# EasyEDA Pro project ProProject_NFC_SJTU-电院版本-NFC名片.epro

# Schematic Schematic1
Create Date: 2023-11-04; Page Name: P1; Project Name: NFC_SJTU-电院版本V4.2; Schematic Name: Schematic1; Update Date: 2023-11-04; Company: 嘉立创EDA; Page Size: A4; Version: V1.0
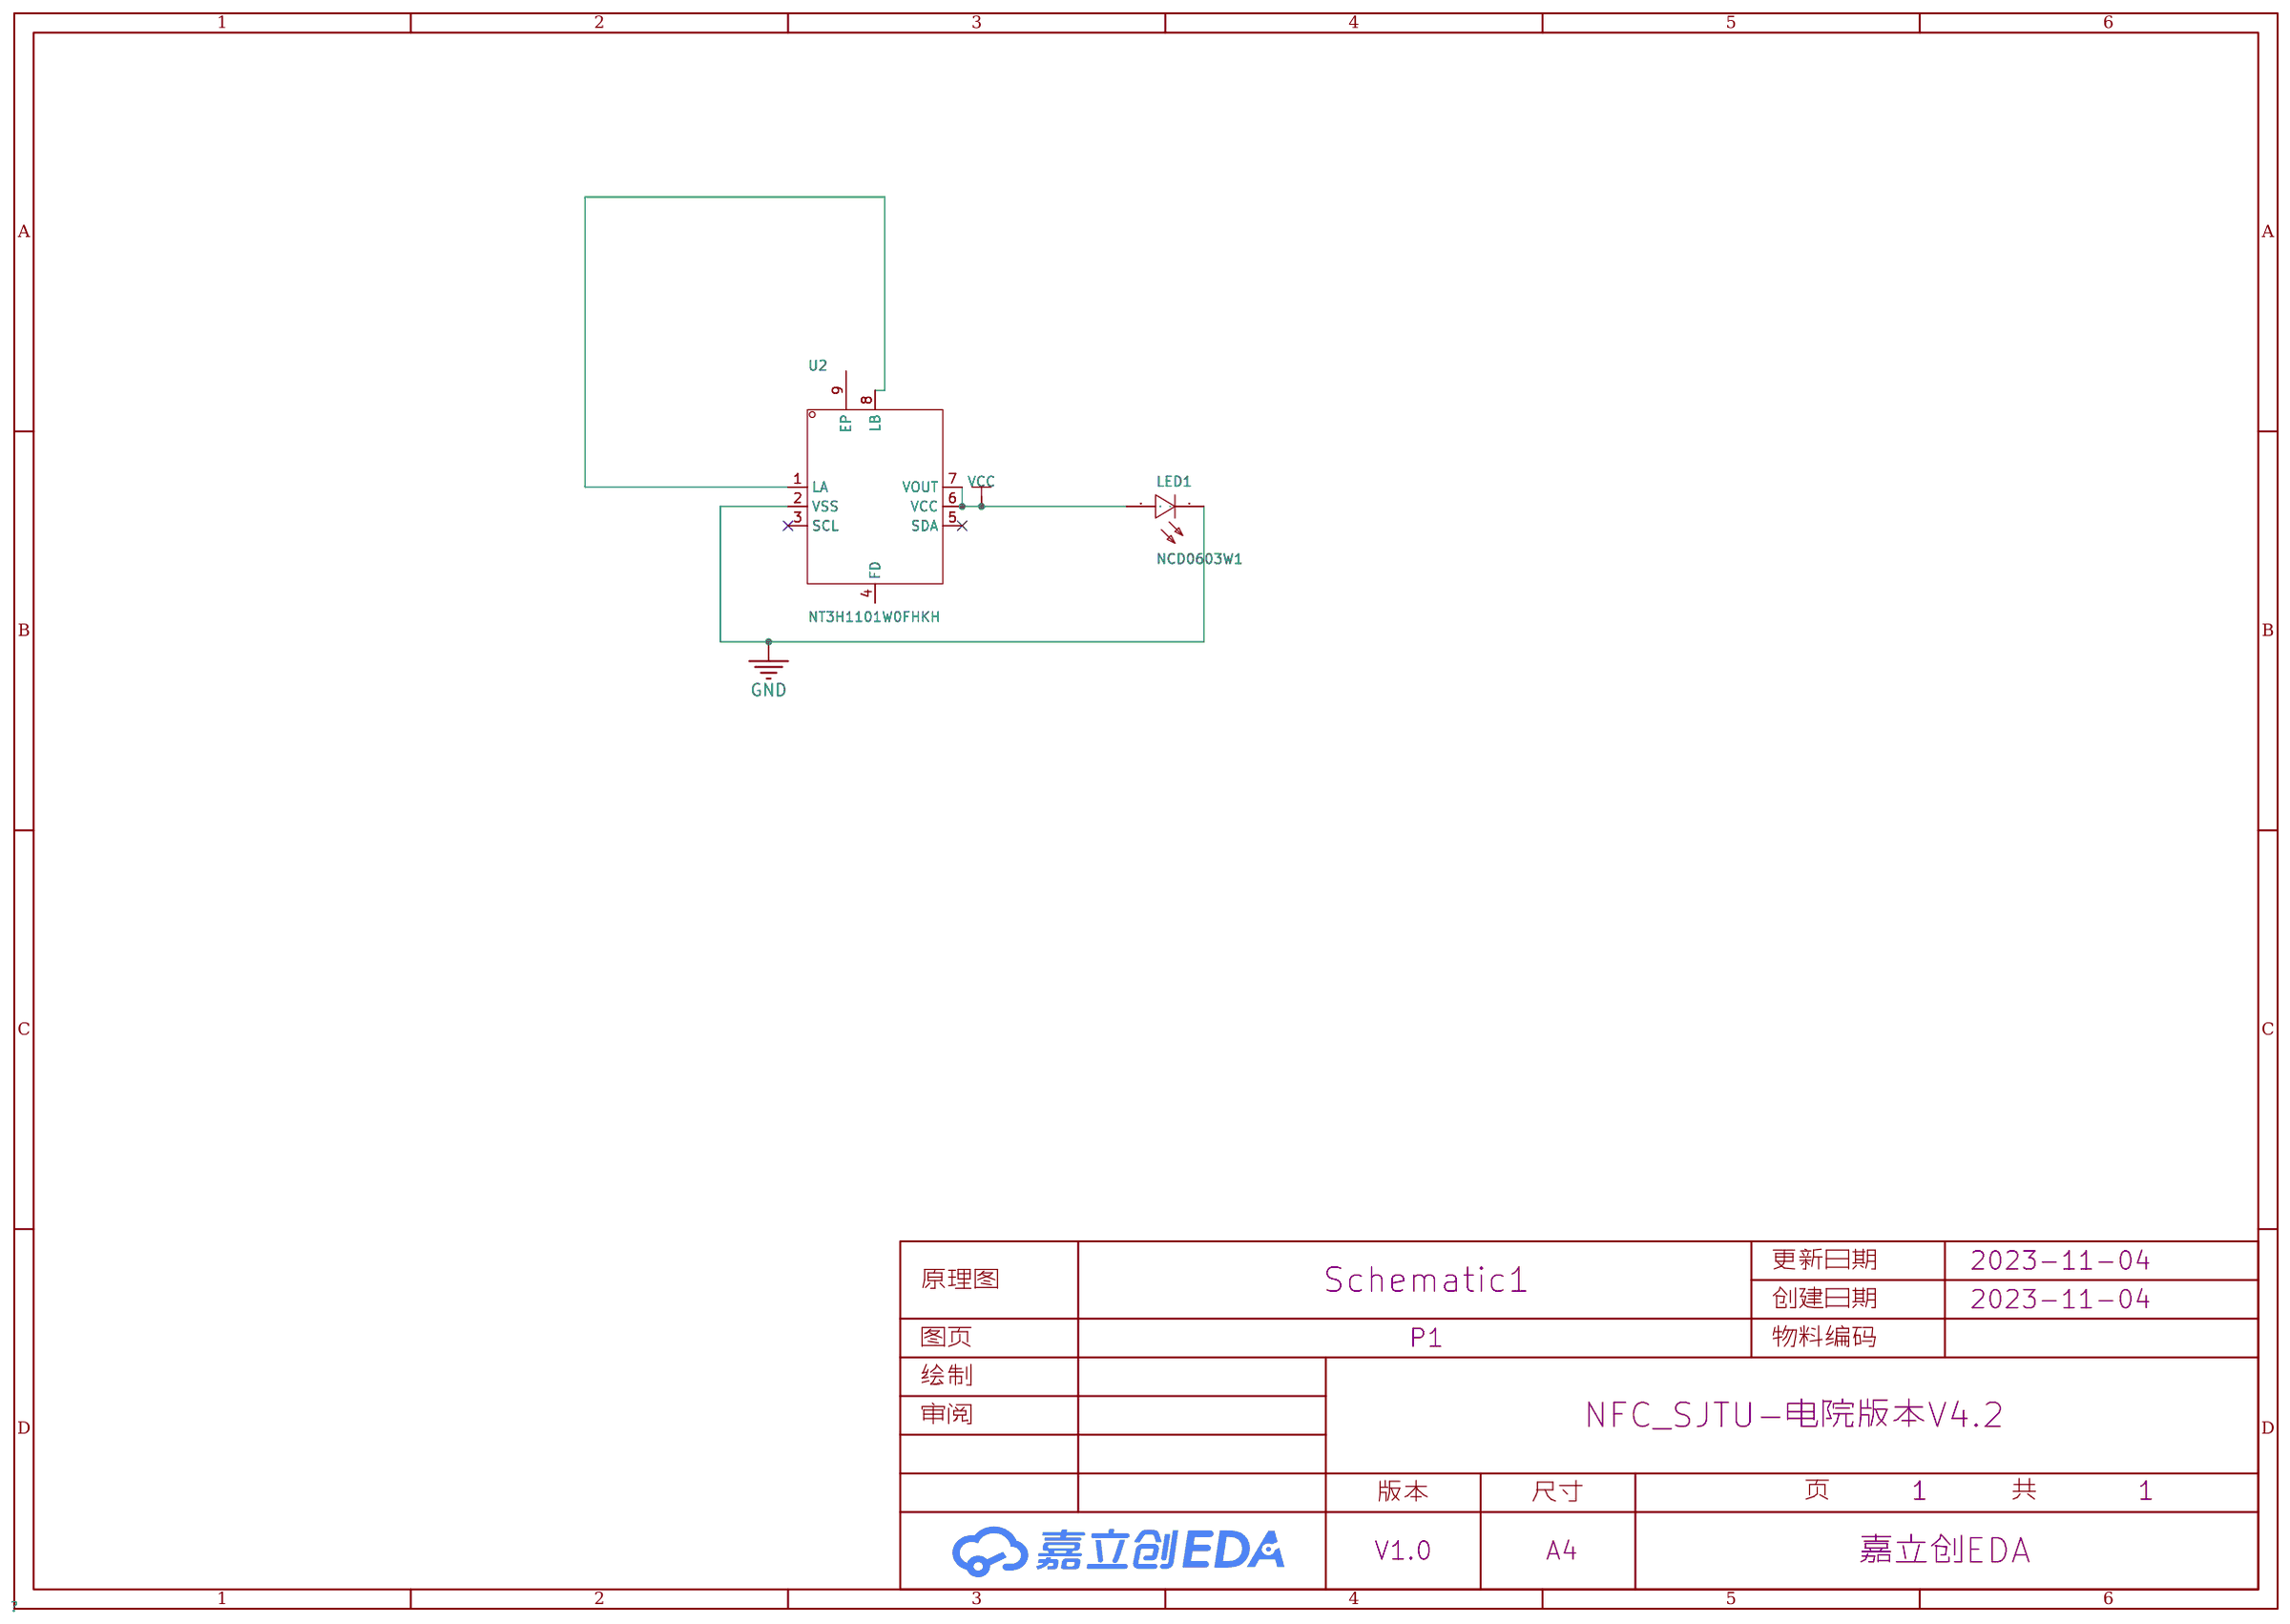
[diagram p0: schematic sheet]

## Parts
LED1  NCD0603W1  [LED0603-RD]
U2  NT3H1101W0FHKH  [XQFN-8_L1.6-W1.6-P0.50-BR]

## Library data of the parts
LED1 = NCD0603W1: 发光颜色:白灯;; Supplier Part: C84265; Manufacturer: 国星光电; Supplier Footprint: 0603; Datasheet: https://atta.szlcsc.com/upload/public/pdf/source/20200820/C84265_479E6193713348A548E5CD6D9278BF16.pdf; Supplier: LCSC; Emitted Color: 白灯
U2 = NT3H1101W0FHKH: Supplier Part: C73156; Manufacturer: NXP(恩智浦); Supplier Footprint: XQFN-8(1.6x1.6); Datasheet: https://atta.szlcsc.com/upload/public/pdf/source/20171113/C73156_15105616225541116096.pdf; Supplier: LCSC

## Nets
GND: LED1.1(-) U2.2(VSS)
VCC: LED1.2(+) U2.6(VCC) U2.7(VOUT)
$1N599: U2.1(LA) U2.8(LB)

Not connected (* = marked no-connect by the designer): U2 3(SCL)* 4(FD) 5(SDA)* 9(EP)

# Board PCB2
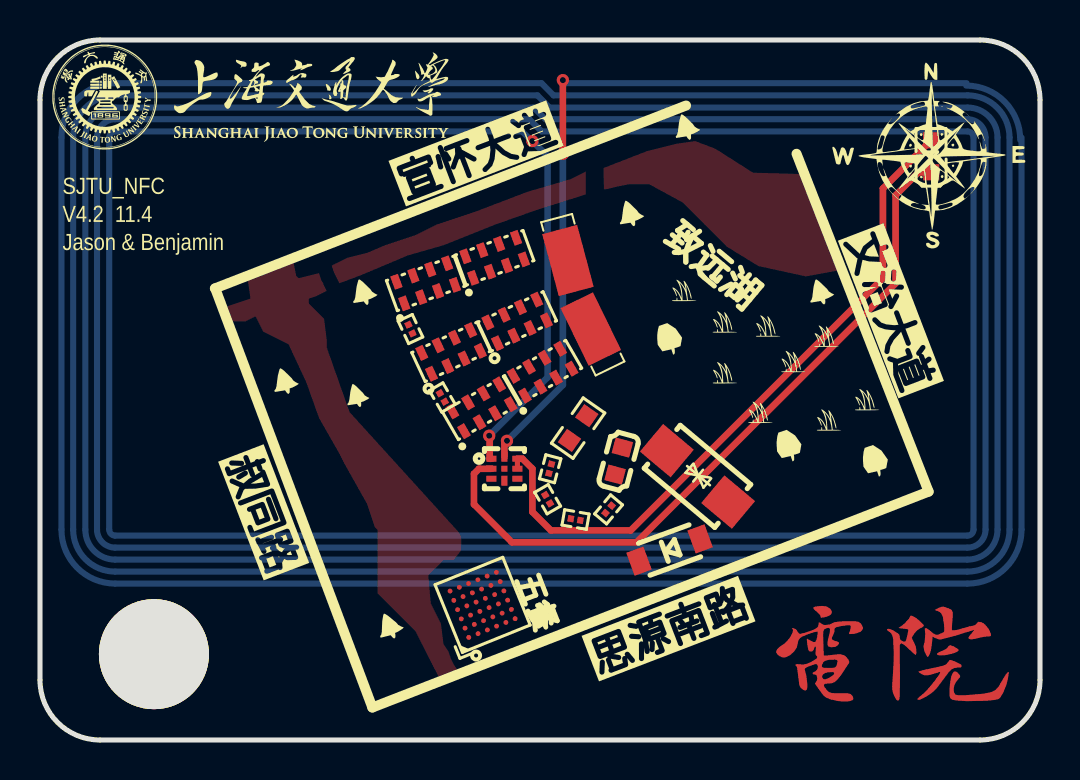
[diagram p1: board, top side]
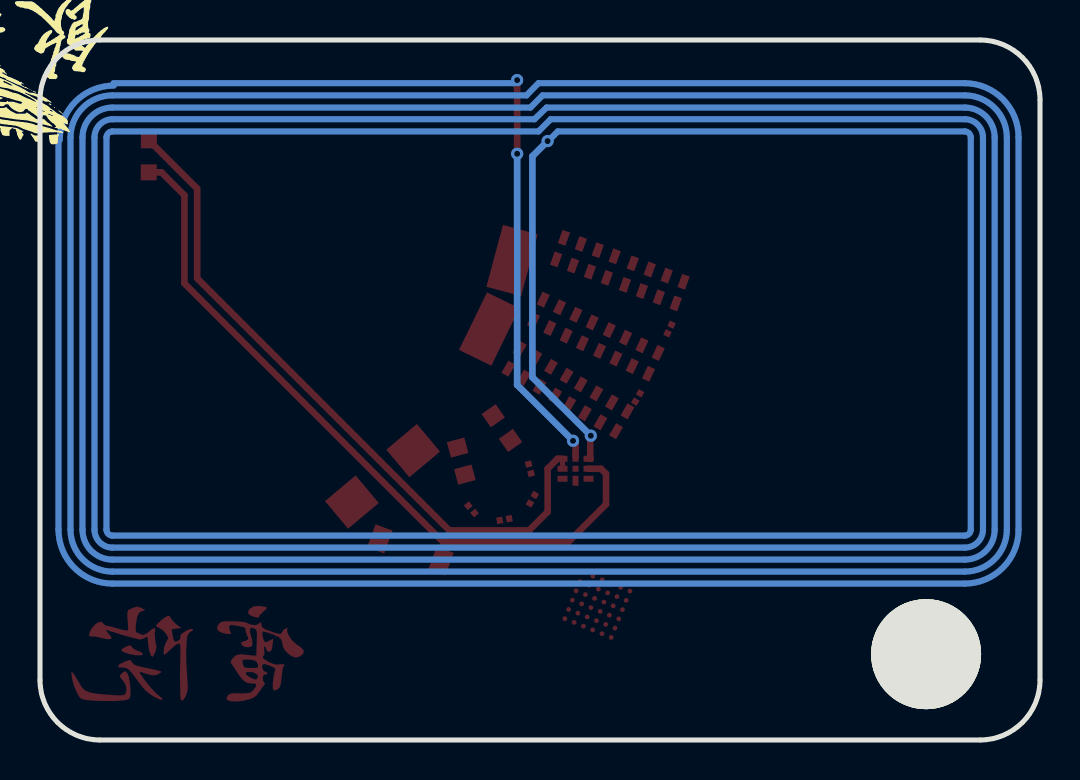
[diagram p2: board, bottom side, seen from below]

Outline 50 x 35 mm; copper layers: Top Layer, Bottom Layer. Coordinates in mm from the lower left corner of the outline.
Outline path: 0,32 0,3 arc(0.88,0.88) 3,0 47,0 arc(49.12,0.88) 50,3 50,32 arc(49.12,34.12) 47,35 3,35 arc(0.88,34.12) 0,32
Stack: Top Layer 0.035mm / Dielectric1 1.51mm FR4 er 4.5 / Bottom Layer 0.035mm

## Design rules (mm)
template: JLCPCB Capability(Two Layers Board)
spacing copperThickness1oz (default): track to track 0.102, other pairs 0.152 to 0.3
spacing copperThickness2oz: track to track 0.203, other pairs 0.152 to 0.3
track width copperThickness1oz (default): min 0.127, default 0.254, max 2.54
track width copperThickness2oz: min 0.203, default 0.254, max 2.54
differential pair differentialPair (default): width min 0.127, default 0.254, max 2.54; gap min 0.152, default 0.152
via viaSize (default): diameter min 0.5, default 0.61, max 10; hole min 0.3, default 0.305, max 6.3

## Placement (name value [footprint] x y rotation side)
C1  100nF  [C0603]  28.94 13.94 75 top
D1  -  [SOD-123_L2.7-W1.6-LS3.7-R-RD]  31.48 9.5 20 top
LED1  NCD0603W1  [LED0603-RD]  44.56 29.18 90 top
NOREF  -  [Pad_e83]  5.7 4.29 0 top
R1  10kΩ  [R0603]  26.91 15.59 55 top
R2  -  [R0201]  25.51 13.56 75 top
R2#2  -  [R0201]  25.38 12.04 120 top
R2#3  -  [R0201]  26.78 11.02 170 top
R2#4  -  [R0201]  28.43 11.53 50 top
R2#5  -  [R0201]  18.52 20.55 115 top
R2#6  -  [R0201]  20.12 17.13 120 top
U1  -  [LCC-8_L3.2-W1.5-P0.90-BL]  25.13 18.39 30 top
U1#2  -  [LCC-8_L3.2-W1.5-P0.90-BL#2]  22.73 24.11 20 top
U1#3  -  [LCC-8_L3.2-W1.5-P0.90-BL#2]  19.28 22.83 20 top
U1#4  -  [LCC-8_L3.2-W1.5-P0.90-BL#2]  20.56 19.41 25 top
U1#5  -  [LCC-8_L3.2-W1.5-P0.90-BL#2]  23.86 20.93 25 top
U1#6  -  [LCC-8_L3.2-W1.5-P0.90-BL]  22.08 16.61 30 top
U2  NT3H1101W0FHKH  [XQFN-8_L1.6-W1.6-P0.50-BR]  23.22 13.56 180 top
U9  -  [BGA-36_L3.5-W3.5-R6-R6-P0.50-BL]  21.95 6.83 22 top
U13  -  [ANT-SMD_MUPS1101-3H]  26.4 23.98 285 top
U13#2  -  [ANT-SMD_MUPS1101-3H]  27.54 20.55 116 top
U15  -  [SMA_L4.4-W2.6-LS5.0-BI]  32.87 13.18 140 top

## Footprints (pads in the part's own frame, mm; a bottom-side part is the same pattern mirrored in y, then rotated)
ANT-SMD_MUPS1101-3H
  rect 3.2x1.8 smd: 1(0,0)
BGA-36_L3.5-W3.5-R6-R6-P0.50-BL
  round 0.24 smd: A1(-1.113,-1.387) A2(-1.113,-0.886) A3(-1.113,-0.387) A4(-1.113,0.114) A5(-1.113,0.614) A6(-1.113,1.113) B1(-0.614,-1.387) B2(-0.614,-0.886) B3(-0.614,-0.387) B4(-0.614,0.114) B5(-0.614,0.614) B6(-0.614,1.113) C1(-0.114,-1.387) C2(-0.114,-0.886) C3(-0.114,-0.387) C4(-0.114,0.114) C5(-0.114,0.614) C6(-0.114,1.113) D1(0.387,-1.387) D2(0.387,-0.886) D3(0.387,-0.387) D4(0.387,0.114) D5(0.387,0.614) D6(0.387,1.113) E1(0.886,-1.387) E2(0.886,-0.886) E3(0.886,-0.387) E4(0.886,0.114) E5(0.886,0.614) E6(0.886,1.113) F1(1.387,-1.386) F2(1.387,-0.886) F3(1.387,-0.387) F4(1.387,0.113) F5(1.387,0.614) F6(1.387,1.113)
C0603
  rect 0.8x0.9 smd: 1(-0.7,0) 2(0.7,0)
LCC-8_L3.2-W1.5-P0.90-BL
  rect 0.4x0.697 smd: 1(-1.35,-0.574) 2(-0.45,-0.574) 3(0.45,-0.574) 4(1.35,-0.574) 5(1.35,0.574) 6(0.45,0.574) 7(-0.45,0.574) 8(-1.35,0.574)
LCC-8_L3.2-W1.5-P0.90-BL#2
  rect 0.4x0.697 smd: 1(-1.35,-0.574) 2(-0.45,-0.574) 3(0.45,-0.574) 4(1.35,-0.574) 5(1.35,0.574) 6(0.45,0.574) 7(-0.45,0.574) 8(-1.35,0.574)
LED0603-RD
  rect 0.8x0.8 smd: 1(-0.799,-0.004) 2(0.799,0.004)
Pad_e83
  round 5.5 hole 5.5: 1(0,0)
R0201
  rect 0.303x0.324 smd: 1(-0.241,0) 2(0.241,0)
R0603
  rect 0.806x0.864 smd: 1(-0.753,0) 2(0.753,0)
SMA_L4.4-W2.6-LS5.0-BI
  rect 2x1.8 smd: 1(-2,0) 2(2,0)
SOD-123_L2.7-W1.6-LS3.7-R-RD
  rect 0.909x1.219 smd: 1(1.625,0) 2(-1.625,0)
XQFN-8_L1.6-W1.6-P0.50-BR
  rect 0.5x0.3 smd: 1(0.65,-0.5) 2(0.65,0) 3(0.65,0.5) 5(-0.65,0.5) 6(-0.65,0) 7(-0.65,-0.5)
  rect 0.3x0.5 smd: 4(0,0.6) 8(0,-0.6)
  rect 0.3x0.3 smd: 9(0,0)

## Nets
As in the schematic.

Pads without a net: C1 1 2; D1 1 2; NOREF 1; R1 1 2; R2 1 2; R2#2 1 2; R2#3 1 2; R2#4 1 2; R2#5 1 2; R2#6 1 2; U1 1 2 3 4 5 6 7 8; U1#2 1 2 3 4 5 6 7 8; U1#3 1 2 3 4 5 6 7 8; U1#4 1 2 3 4 5 6 7 8; U1#5 1 2 3 4 5 6 7 8; U1#6 1 2 3 4 5 6 7 8; U2 3 4 5 9; U9 A1 A2 A3 A4 A5 A6 B1 B2 B3 B4 B5 B6 C1 C2 C3 C4 C5 C6 D1 D2 D3 D4 D5 D6 E1 E2 E3 E4 E5 E6 F1 F2 F3 F4 F5 F6; U13 1; U13#2 1; U15 1 2

## Via types
v1: diameter 0.61, hole 0.305, Top Layer to Bottom Layer, 5 vias

## Routing (per net, layer and track width the routed paths; a pad name or vN(x,y) marks a point on that pad's centre or on a via; arc(x,y) is an arc through that point)
GND: length 36.4
  Top Layer w0.305: 22.57,13.56 arc(22.57,13.56) 22.57,13.56
  Top Layer w0.33: U2.2 21.95,13.56 21.7,13.31 21.7,11.78 23.6,9.89 29.83,9.89 42.78,22.83 42.78,27.24 43.93,28.38 LED1.1
VCC: length 34.6
  Top Layer w0.254: U2.6 U2.7
  Top Layer w0.33: U2.7 24.12,14.06 24.62,13.56 24.62,11.4 25.54,10.48 29.53,10.48 42.15,23.09 42.15,27.57 LED1.2
$1N599: length 706.6
  Top Layer w0.33: v1(23.35,14.96) 23.22,14.83 U2.8 ; U2.1 22.49,14.06 22.49,15.19 v1(22.46,15.21) ; v1(26.14,32.99) v1(26.14,29.31)
  Bottom Layer w0.254: 24.45,30.09 24.48,30.09 v1(24.62,29.95)
  Bottom Layer w0.305: v1(26.14,32.99) 26.3,32.84 46.33,32.84 ; 24.45,30.09 24.11,30.43 3.77,30.43 arc(3.55,30.34) 3.46,30.12 3.46,10.52 arc(3.55,10.31) 3.77,10.22 46.38,10.22 arc(46.59,10.31) 46.68,10.52 46.68,30.12 arc(46.59,30.34) 46.38,30.43 25.08,30.43 24.47,31.04 3.77,31.04 arc(3.12,30.77) 2.85,30.12 2.85,10.52 arc(3.12,9.88) 3.77,9.62 46.38,9.62 arc(47.01,9.88) 47.28,10.52 47.28,30.12 arc(47.02,30.77) 46.38,31.04 25.28,31.04 24.67,31.62 3.77,31.62 arc(2.71,31.18) 2.27,30.12 2.27,10.52 arc(2.71,9.46) 3.77,9.02 46.38,9.02 arc(47.44,9.46) 47.88,10.52 47.88,30.12 arc(47.44,31.18) 46.38,31.62 25.48,31.62 24.87,32.23 3.77,32.23 arc(2.27,31.61) 1.66,30.12 1.66,10.52 arc(2.28,9.03) 3.77,8.42 46.38,8.42 arc(47.86,9.03) 48.48,10.52 48.48,30.12 arc(47.86,31.61) 46.38,32.23 25.68,32.23 25.08,32.84 3.77,32.84 arc(1.86,32.04) 1.07,30.12 1.07,10.52 arc(1.86,8.61) 3.77,7.82 46.38,7.82 arc(48.29,8.61) 49.08,10.52 49.08,30.12 ; 49.01,30 arc(48.22,31.92) 46.31,32.72
  Bottom Layer w0.33: v1(26.14,29.31) 26.14,17.75 v1(23.35,14.96) ; v1(24.62,29.95) 25.38,29.18 25.38,18.14 v1(22.46,15.21)

## Copper pours and planes (outline as drawn; the poured copper is in the pictures)
(no net) on Top Layer: 14.59,28.42 27.29,28.42 27.29,22.83 14.59,22.83
(no net) on Top Layer: 28.18,29.95 39.86,29.95 39.86,23.18 28.18,23.18
(no net) on Top Layer: 9.38,23.85 21.06,23.85 21.06,3.18 9.38,3.18

Small or netless copper shapes (teardrops, artwork), in the pictures only: 8 on Top Layer

## Text on the board
Top Silkscreen Layer: SJTU_NFC / V4.2  11.4 / Jason & Benjamin | 五餐 | 致远湖 | 宣怀大道 | 思源南路 | 叔同路 | 文治大道
